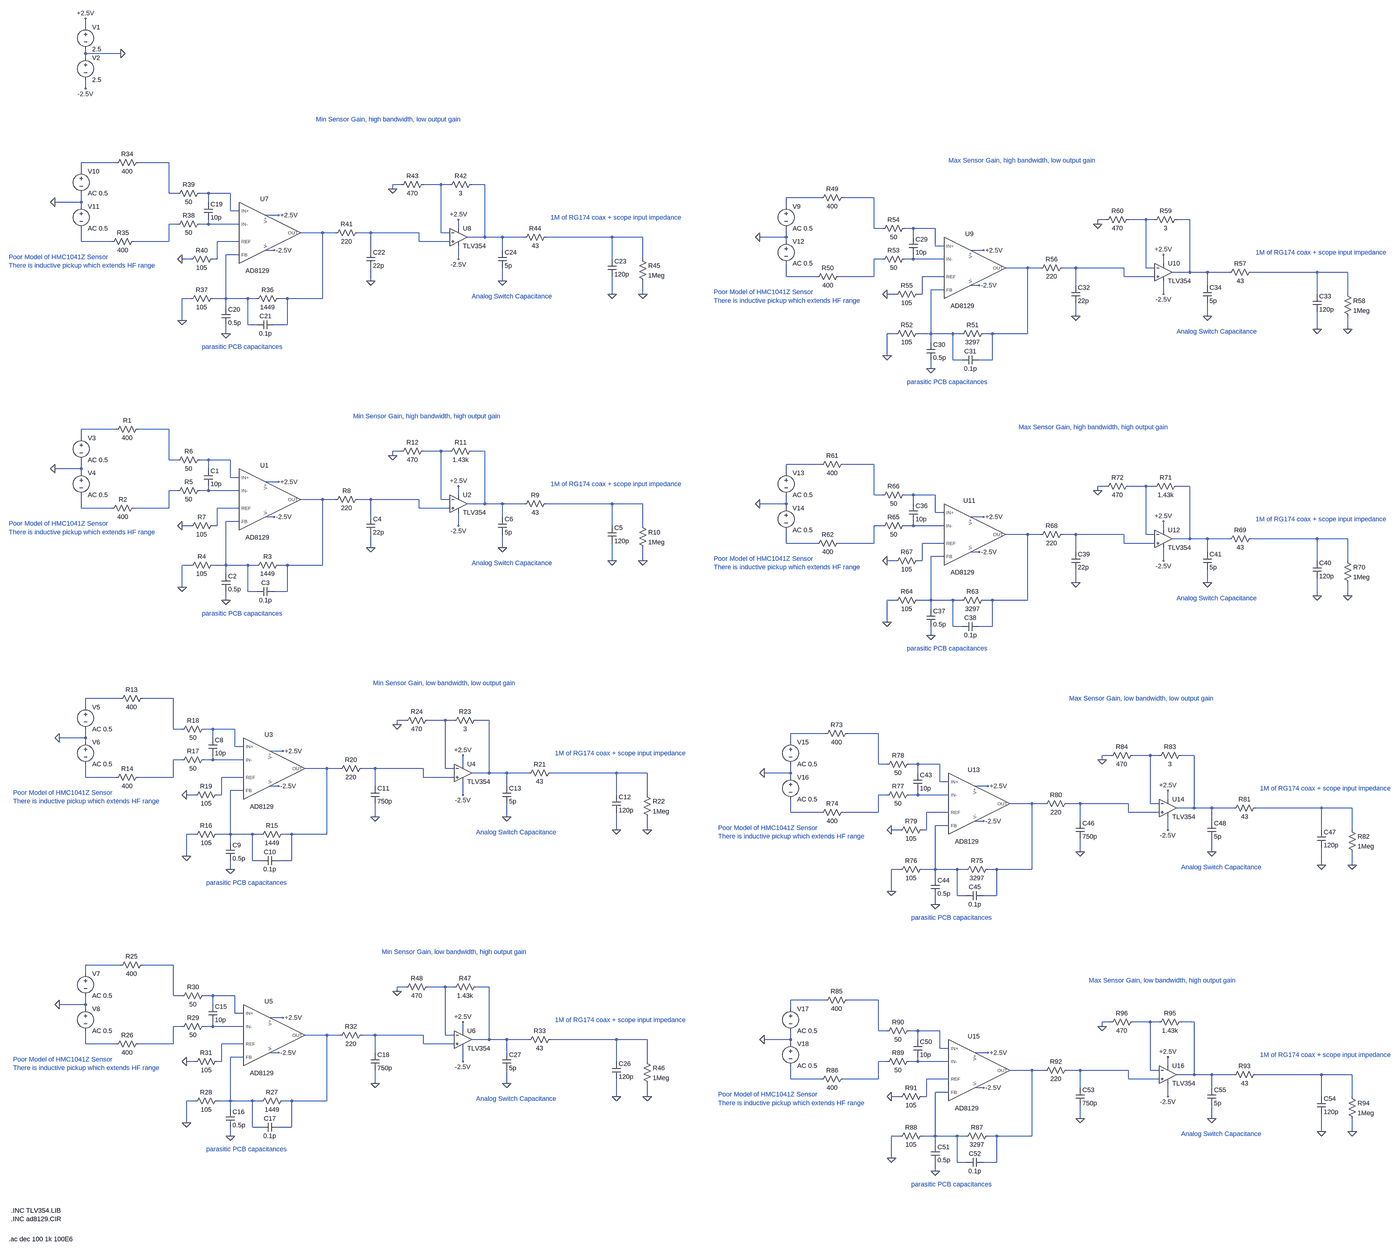
[diagram p0: schematic amplifier.asc, whole sheet]
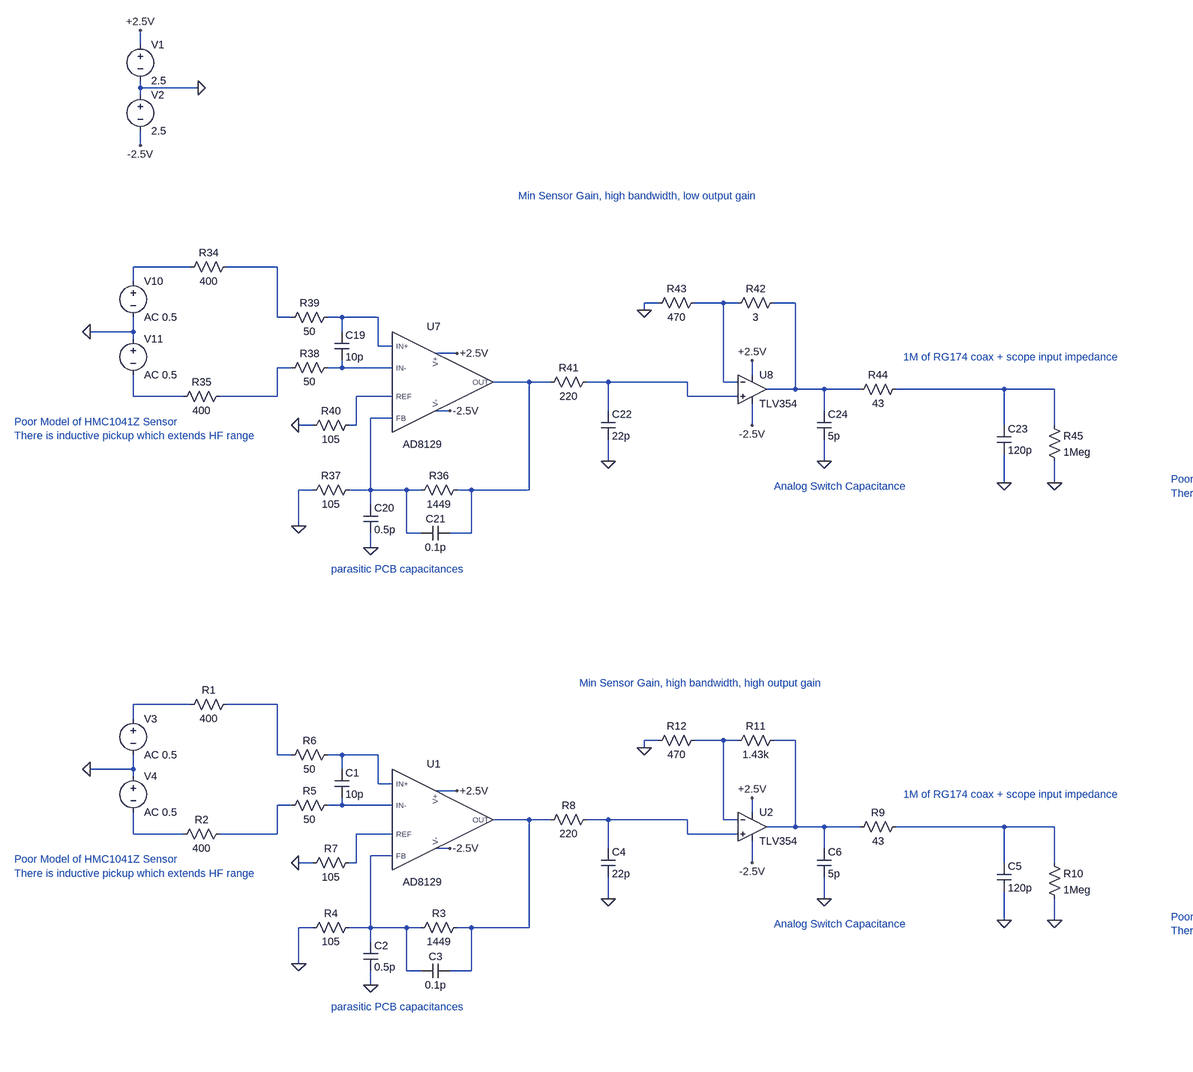
[diagram p1: schematic amplifier.asc, part, row 1 of 2, column 1 of 2]
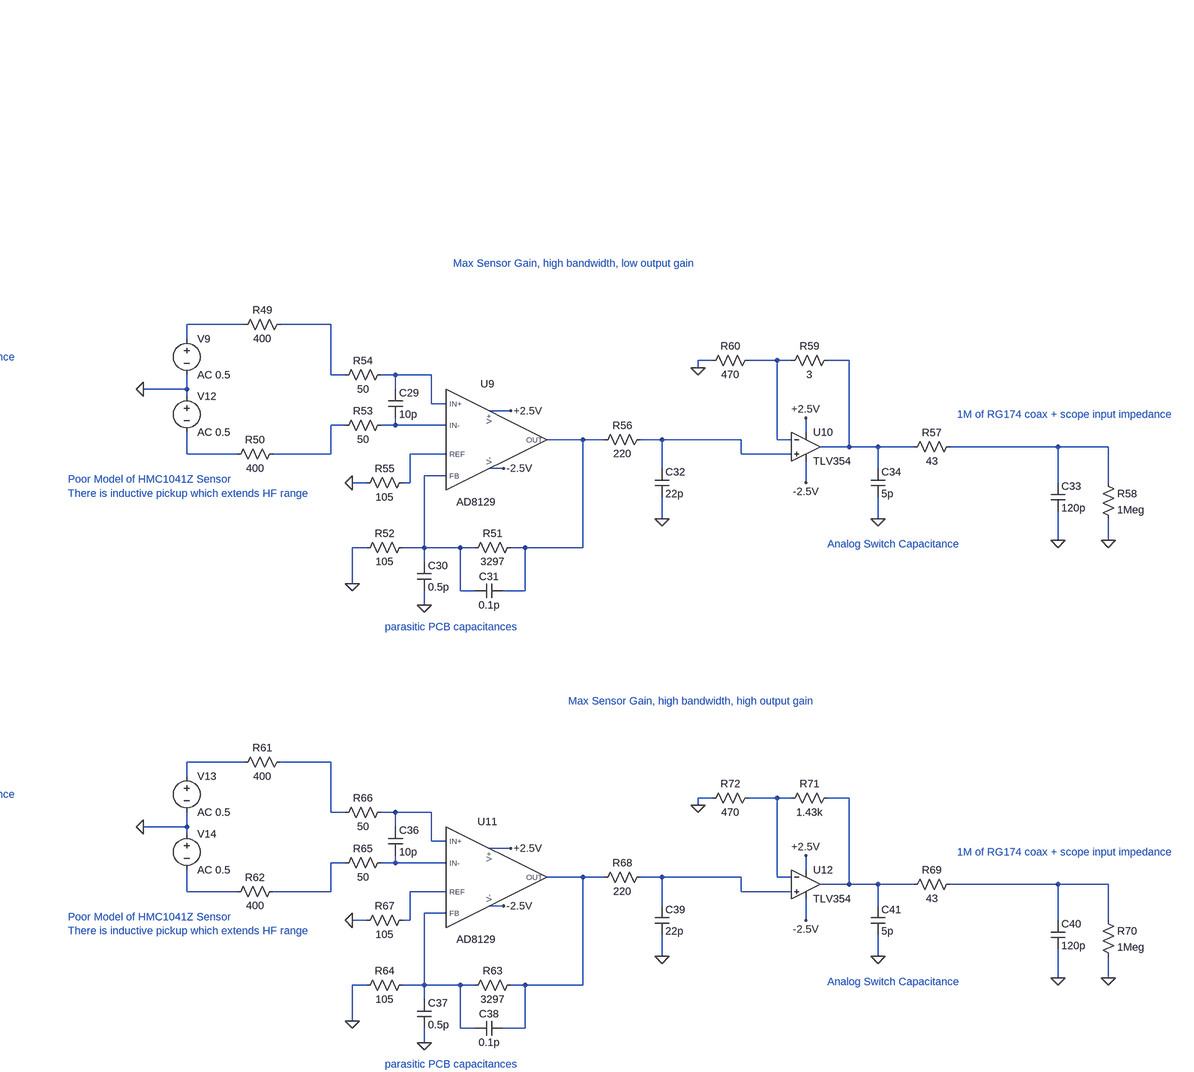
[diagram p2: schematic amplifier.asc, part, row 1 of 2, column 2 of 2]
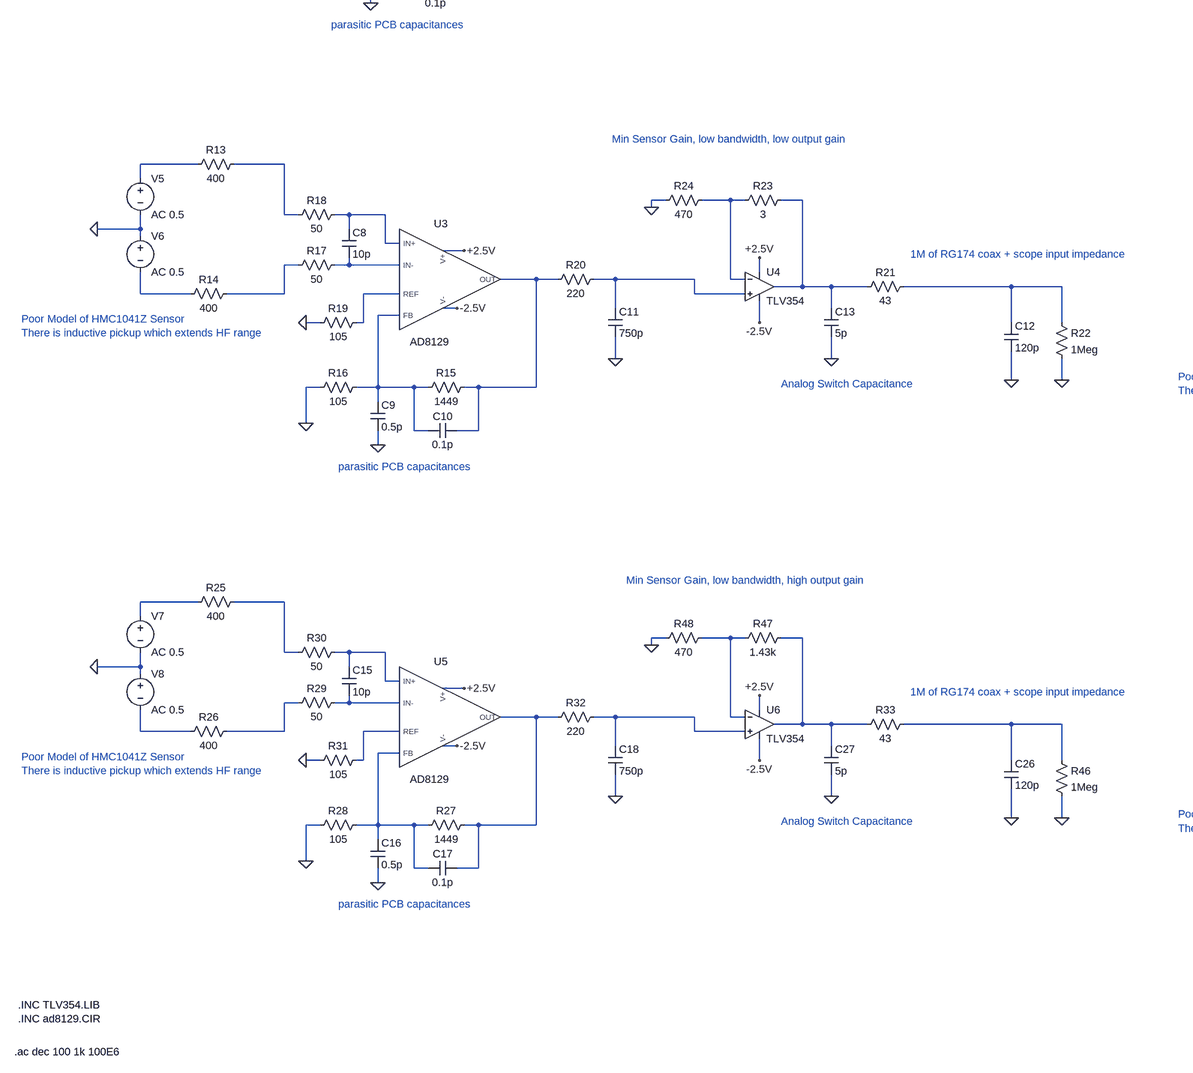
[diagram p3: schematic amplifier.asc, part, row 2 of 2, column 1 of 2]
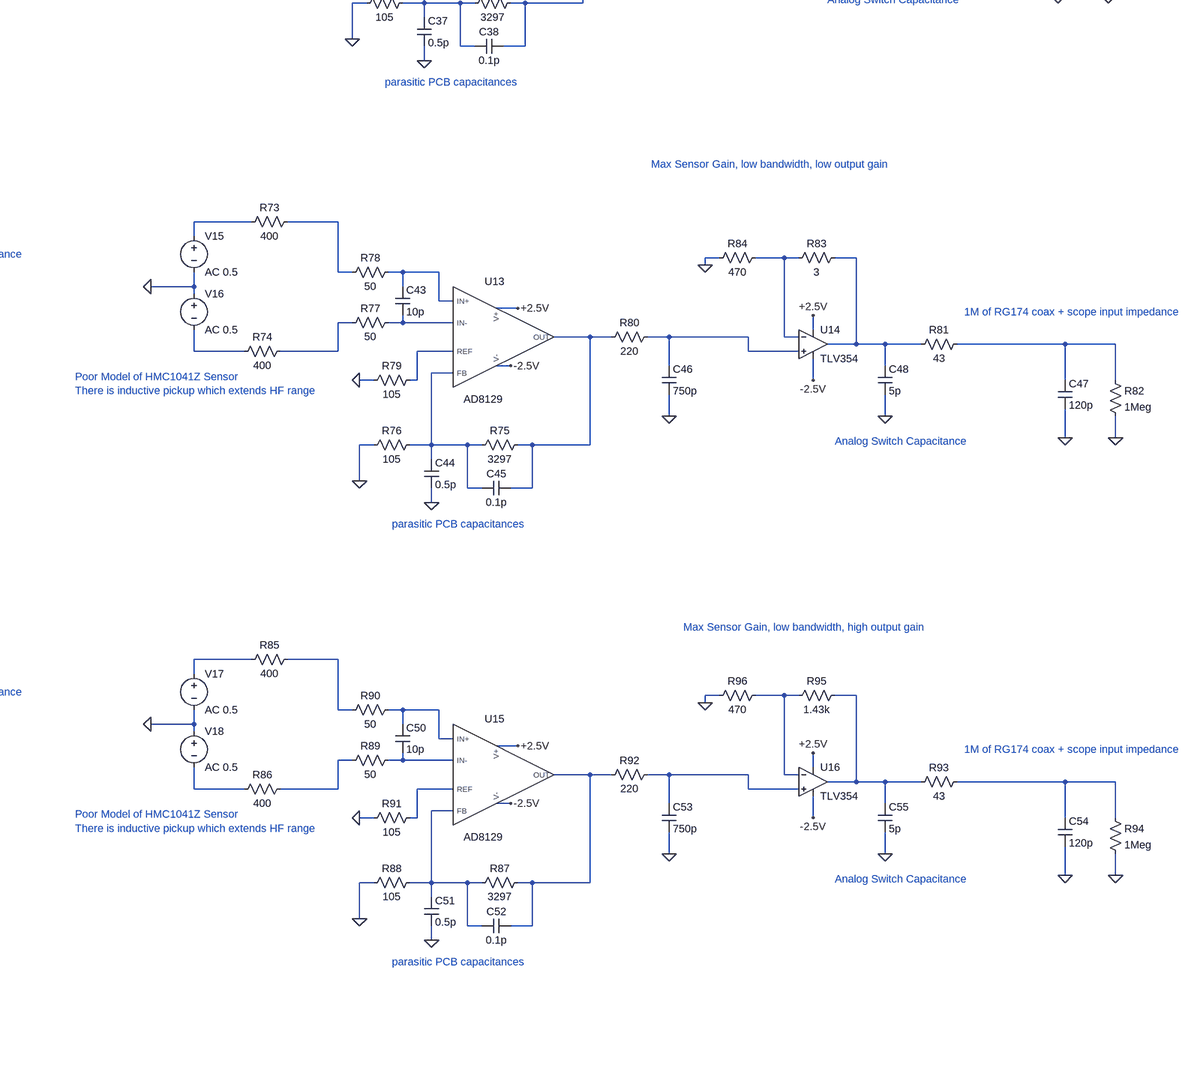
[diagram p4: schematic amplifier.asc, part, row 2 of 2, column 2 of 2]
amplifier.asc, the LTspice schematic file:
Version 4
SHEET 1 3488 3368
WIRE -2000 -1584 -2000 -1616
WIRE -2000 -1488 -2000 -1504
WIRE -1872 -1488 -2000 -1488
WIRE -2000 -1472 -2000 -1488
WIRE -2000 -1360 -2000 -1392
WIRE -1888 -1088 -2016 -1088
WIRE -1696 -1088 -1808 -1088
WIRE -2016 -1056 -2016 -1088
WIRE -848 -1008 -880 -1008
WIRE -704 -1008 -768 -1008
WIRE -672 -1008 -704 -1008
WIRE -544 -1008 -592 -1008
WIRE -880 -992 -880 -1008
WIRE -1696 -976 -1696 -1088
WIRE -1664 -976 -1696 -976
WIRE -1552 -976 -1584 -976
WIRE -1472 -976 -1552 -976
WIRE 1376 -960 1248 -960
WIRE 1568 -960 1456 -960
WIRE -2016 -944 -2016 -976
WIRE -2016 -944 -2112 -944
WIRE -1552 -944 -1552 -976
WIRE -2016 -928 -2016 -944
WIRE 1248 -928 1248 -960
WIRE -1472 -912 -1472 -976
WIRE -1440 -912 -1472 -912
WIRE -1296 -896 -1344 -896
WIRE 2416 -880 2384 -880
WIRE 2560 -880 2496 -880
WIRE 2592 -880 2560 -880
WIRE 2720 -880 2672 -880
WIRE -1664 -864 -1696 -864
WIRE -1552 -864 -1552 -880
WIRE -1552 -864 -1584 -864
WIRE -1440 -864 -1552 -864
WIRE 2384 -864 2384 -880
WIRE -640 -848 -640 -880
WIRE 1568 -848 1568 -960
WIRE 1600 -848 1568 -848
WIRE 1712 -848 1680 -848
WIRE 1792 -848 1712 -848
WIRE -1136 -832 -1216 -832
WIRE -1088 -832 -1136 -832
WIRE -960 -832 -1008 -832
WIRE -784 -832 -960 -832
WIRE -704 -832 -704 -1008
WIRE -672 -832 -704 -832
WIRE -544 -816 -544 -1008
WIRE -544 -816 -608 -816
WIRE -480 -816 -544 -816
WIRE -400 -816 -480 -816
WIRE -80 -816 -320 -816
WIRE 32 -816 -80 -816
WIRE 1248 -816 1248 -848
WIRE 1248 -816 1152 -816
WIRE 1712 -816 1712 -848
WIRE -2016 -800 -2016 -848
WIRE -1904 -800 -2016 -800
WIRE -1696 -800 -1696 -864
WIRE -1696 -800 -1824 -800
WIRE -1440 -800 -1520 -800
WIRE -784 -800 -784 -832
WIRE -672 -800 -784 -800
WIRE 1248 -800 1248 -816
WIRE 1792 -784 1792 -848
WIRE 1824 -784 1792 -784
WIRE -1312 -768 -1344 -768
WIRE -960 -768 -960 -832
WIRE -480 -768 -480 -816
WIRE 1968 -768 1920 -768
WIRE -1440 -752 -1488 -752
WIRE -1616 -736 -1648 -736
WIRE -1520 -736 -1520 -800
WIRE -1520 -736 -1536 -736
WIRE -640 -736 -640 -784
WIRE -80 -736 -80 -816
WIRE 32 -736 32 -816
WIRE 1600 -736 1568 -736
WIRE 1712 -736 1712 -752
WIRE 1712 -736 1680 -736
WIRE 1824 -736 1712 -736
WIRE 2624 -720 2624 -752
WIRE 2128 -704 2048 -704
WIRE 2176 -704 2128 -704
WIRE 2304 -704 2256 -704
WIRE 2480 -704 2304 -704
WIRE 2560 -704 2560 -880
WIRE 2592 -704 2560 -704
WIRE 2720 -688 2720 -880
WIRE 2720 -688 2656 -688
WIRE 2784 -688 2720 -688
WIRE 2864 -688 2784 -688
WIRE 3184 -688 2944 -688
WIRE 3296 -688 3184 -688
WIRE 1248 -672 1248 -720
WIRE 1360 -672 1248 -672
WIRE 1568 -672 1568 -736
WIRE 1568 -672 1440 -672
WIRE 1824 -672 1744 -672
WIRE 2480 -672 2480 -704
WIRE 2592 -672 2480 -672
WIRE -960 -656 -960 -704
WIRE -480 -656 -480 -704
WIRE 1952 -640 1920 -640
WIRE 2304 -640 2304 -704
WIRE 2784 -640 2784 -688
WIRE 1824 -624 1776 -624
WIRE -80 -608 -80 -672
WIRE 32 -608 32 -656
WIRE 1648 -608 1616 -608
WIRE 1744 -608 1744 -672
WIRE 1744 -608 1728 -608
WIRE 2624 -608 2624 -656
WIRE 3184 -608 3184 -688
WIRE 3296 -608 3296 -688
WIRE -1616 -592 -1648 -592
WIRE -1488 -592 -1488 -752
WIRE -1488 -592 -1536 -592
WIRE -1408 -592 -1488 -592
WIRE -1376 -592 -1408 -592
WIRE -1264 -592 -1296 -592
WIRE -1136 -592 -1136 -832
WIRE -1136 -592 -1264 -592
WIRE -1488 -560 -1488 -592
WIRE 2304 -528 2304 -576
WIRE 2784 -528 2784 -576
WIRE -1648 -512 -1648 -592
WIRE -1408 -496 -1408 -592
WIRE -1376 -496 -1408 -496
WIRE -1264 -496 -1264 -592
WIRE -1264 -496 -1312 -496
WIRE 3184 -480 3184 -544
WIRE 3296 -480 3296 -528
WIRE -1488 -464 -1488 -496
WIRE 1648 -464 1616 -464
WIRE 1776 -464 1776 -624
WIRE 1776 -464 1728 -464
WIRE 1856 -464 1776 -464
WIRE 1888 -464 1856 -464
WIRE 2000 -464 1968 -464
WIRE 2128 -464 2128 -704
WIRE 2128 -464 2000 -464
WIRE 1776 -432 1776 -464
WIRE 1616 -384 1616 -464
WIRE 1856 -368 1856 -464
WIRE 1888 -368 1856 -368
WIRE 2000 -368 2000 -464
WIRE 2000 -368 1952 -368
WIRE 1776 -336 1776 -368
WIRE -1888 0 -2016 0
WIRE -1696 0 -1808 0
WIRE -2016 32 -2016 0
WIRE -848 80 -880 80
WIRE -704 80 -768 80
WIRE -672 80 -704 80
WIRE -544 80 -592 80
WIRE -880 96 -880 80
WIRE -1696 112 -1696 0
WIRE -1664 112 -1696 112
WIRE -1552 112 -1584 112
WIRE -1472 112 -1552 112
WIRE 1376 128 1248 128
WIRE 1568 128 1456 128
WIRE -2016 144 -2016 112
WIRE -2016 144 -2112 144
WIRE -1552 144 -1552 112
WIRE -2016 160 -2016 144
WIRE 1248 160 1248 128
WIRE -1472 176 -1472 112
WIRE -1440 176 -1472 176
WIRE -1296 192 -1344 192
WIRE 2416 208 2384 208
WIRE 2560 208 2496 208
WIRE 2592 208 2560 208
WIRE 2720 208 2672 208
WIRE -1664 224 -1696 224
WIRE -1552 224 -1552 208
WIRE -1552 224 -1584 224
WIRE -1440 224 -1552 224
WIRE 2384 224 2384 208
WIRE -640 240 -640 208
WIRE 1568 240 1568 128
WIRE 1600 240 1568 240
WIRE 1712 240 1680 240
WIRE 1792 240 1712 240
WIRE -1136 256 -1216 256
WIRE -1088 256 -1136 256
WIRE -960 256 -1008 256
WIRE -784 256 -960 256
WIRE -704 256 -704 80
WIRE -672 256 -704 256
WIRE -544 272 -544 80
WIRE -544 272 -608 272
WIRE -480 272 -544 272
WIRE -400 272 -480 272
WIRE -80 272 -320 272
WIRE 32 272 -80 272
WIRE 1248 272 1248 240
WIRE 1248 272 1152 272
WIRE 1712 272 1712 240
WIRE -2016 288 -2016 240
WIRE -1904 288 -2016 288
WIRE -1696 288 -1696 224
WIRE -1696 288 -1824 288
WIRE -1440 288 -1520 288
WIRE -784 288 -784 256
WIRE -672 288 -784 288
WIRE 1248 288 1248 272
WIRE 1792 304 1792 240
WIRE 1824 304 1792 304
WIRE -1312 320 -1344 320
WIRE -960 320 -960 256
WIRE -480 320 -480 272
WIRE 1968 320 1920 320
WIRE -1440 336 -1488 336
WIRE -1616 352 -1648 352
WIRE -1520 352 -1520 288
WIRE -1520 352 -1536 352
WIRE -640 352 -640 304
WIRE -80 352 -80 272
WIRE 32 352 32 272
WIRE 1600 352 1568 352
WIRE 1712 352 1712 336
WIRE 1712 352 1680 352
WIRE 1824 352 1712 352
WIRE 2624 368 2624 336
WIRE 2128 384 2048 384
WIRE 2176 384 2128 384
WIRE 2304 384 2256 384
WIRE 2480 384 2304 384
WIRE 2560 384 2560 208
WIRE 2592 384 2560 384
WIRE 2720 400 2720 208
WIRE 2720 400 2656 400
WIRE 2784 400 2720 400
WIRE 2864 400 2784 400
WIRE 3184 400 2944 400
WIRE 3296 400 3184 400
WIRE 1248 416 1248 368
WIRE 1360 416 1248 416
WIRE 1568 416 1568 352
WIRE 1568 416 1440 416
WIRE 1824 416 1744 416
WIRE 2480 416 2480 384
WIRE 2592 416 2480 416
WIRE -960 432 -960 384
WIRE -480 432 -480 384
WIRE 1952 448 1920 448
WIRE 2304 448 2304 384
WIRE 2784 448 2784 400
WIRE 1824 464 1776 464
WIRE -80 480 -80 416
WIRE 32 480 32 432
WIRE 1648 480 1616 480
WIRE 1744 480 1744 416
WIRE 1744 480 1728 480
WIRE 2624 480 2624 432
WIRE 3184 480 3184 400
WIRE 3296 480 3296 400
WIRE -1616 496 -1648 496
WIRE -1488 496 -1488 336
WIRE -1488 496 -1536 496
WIRE -1408 496 -1488 496
WIRE -1376 496 -1408 496
WIRE -1264 496 -1296 496
WIRE -1136 496 -1136 256
WIRE -1136 496 -1264 496
WIRE -1488 528 -1488 496
WIRE 2304 560 2304 512
WIRE 2784 560 2784 512
WIRE -1648 576 -1648 496
WIRE -1408 592 -1408 496
WIRE -1376 592 -1408 592
WIRE -1264 592 -1264 496
WIRE -1264 592 -1312 592
WIRE 3184 608 3184 544
WIRE 3296 608 3296 560
WIRE -1488 624 -1488 592
WIRE 1648 624 1616 624
WIRE 1776 624 1776 464
WIRE 1776 624 1728 624
WIRE 1856 624 1776 624
WIRE 1888 624 1856 624
WIRE 2000 624 1968 624
WIRE 2128 624 2128 384
WIRE 2128 624 2000 624
WIRE 1776 656 1776 624
WIRE 1616 704 1616 624
WIRE 1856 720 1856 624
WIRE 1888 720 1856 720
WIRE 2000 720 2000 624
WIRE 2000 720 1952 720
WIRE 1776 752 1776 720
WIRE -1872 1264 -2000 1264
WIRE -1680 1264 -1792 1264
WIRE -2000 1296 -2000 1264
WIRE -832 1344 -864 1344
WIRE -688 1344 -752 1344
WIRE -656 1344 -688 1344
WIRE -528 1344 -576 1344
WIRE -864 1360 -864 1344
WIRE -1680 1376 -1680 1264
WIRE -1648 1376 -1680 1376
WIRE -1536 1376 -1568 1376
WIRE -1456 1376 -1536 1376
WIRE 1392 1392 1264 1392
WIRE 1584 1392 1472 1392
WIRE -2000 1408 -2000 1376
WIRE -2000 1408 -2096 1408
WIRE -1536 1408 -1536 1376
WIRE -2000 1424 -2000 1408
WIRE 1264 1424 1264 1392
WIRE -1456 1440 -1456 1376
WIRE -1424 1440 -1456 1440
WIRE -1280 1456 -1328 1456
WIRE 2432 1472 2400 1472
WIRE 2576 1472 2512 1472
WIRE 2608 1472 2576 1472
WIRE 2736 1472 2688 1472
WIRE -1648 1488 -1680 1488
WIRE -1536 1488 -1536 1472
WIRE -1536 1488 -1568 1488
WIRE -1424 1488 -1536 1488
WIRE 2400 1488 2400 1472
WIRE -624 1504 -624 1472
WIRE 1584 1504 1584 1392
WIRE 1616 1504 1584 1504
WIRE 1728 1504 1696 1504
WIRE 1808 1504 1728 1504
WIRE -1120 1520 -1200 1520
WIRE -1072 1520 -1120 1520
WIRE -944 1520 -992 1520
WIRE -768 1520 -944 1520
WIRE -688 1520 -688 1344
WIRE -656 1520 -688 1520
WIRE -528 1536 -528 1344
WIRE -528 1536 -592 1536
WIRE -464 1536 -528 1536
WIRE -384 1536 -464 1536
WIRE -64 1536 -304 1536
WIRE 48 1536 -64 1536
WIRE 1264 1536 1264 1504
WIRE 1264 1536 1168 1536
WIRE 1728 1536 1728 1504
WIRE -2000 1552 -2000 1504
WIRE -1888 1552 -2000 1552
WIRE -1680 1552 -1680 1488
WIRE -1680 1552 -1808 1552
WIRE -1424 1552 -1504 1552
WIRE -768 1552 -768 1520
WIRE -656 1552 -768 1552
WIRE 1264 1552 1264 1536
WIRE 1808 1568 1808 1504
WIRE 1840 1568 1808 1568
WIRE -1296 1584 -1328 1584
WIRE -944 1584 -944 1520
WIRE -464 1584 -464 1536
WIRE 1984 1584 1936 1584
WIRE -1424 1600 -1472 1600
WIRE -1600 1616 -1632 1616
WIRE -1504 1616 -1504 1552
WIRE -1504 1616 -1520 1616
WIRE -624 1616 -624 1568
WIRE -64 1616 -64 1536
WIRE 48 1616 48 1536
WIRE 1616 1616 1584 1616
WIRE 1728 1616 1728 1600
WIRE 1728 1616 1696 1616
WIRE 1840 1616 1728 1616
WIRE 2640 1632 2640 1600
WIRE 2144 1648 2064 1648
WIRE 2192 1648 2144 1648
WIRE 2320 1648 2272 1648
WIRE 2496 1648 2320 1648
WIRE 2576 1648 2576 1472
WIRE 2608 1648 2576 1648
WIRE 2736 1664 2736 1472
WIRE 2736 1664 2672 1664
WIRE 2800 1664 2736 1664
WIRE 2880 1664 2800 1664
WIRE 3200 1664 2960 1664
WIRE 3312 1664 3200 1664
WIRE 1264 1680 1264 1632
WIRE 1376 1680 1264 1680
WIRE 1584 1680 1584 1616
WIRE 1584 1680 1456 1680
WIRE 1840 1680 1760 1680
WIRE 2496 1680 2496 1648
WIRE 2608 1680 2496 1680
WIRE -944 1696 -944 1648
WIRE -464 1696 -464 1648
WIRE 1968 1712 1936 1712
WIRE 2320 1712 2320 1648
WIRE 2800 1712 2800 1664
WIRE 1840 1728 1792 1728
WIRE -64 1744 -64 1680
WIRE 48 1744 48 1696
WIRE 1664 1744 1632 1744
WIRE 1760 1744 1760 1680
WIRE 1760 1744 1744 1744
WIRE 2640 1744 2640 1696
WIRE 3200 1744 3200 1664
WIRE 3312 1744 3312 1664
WIRE -1600 1760 -1632 1760
WIRE -1472 1760 -1472 1600
WIRE -1472 1760 -1520 1760
WIRE -1392 1760 -1472 1760
WIRE -1360 1760 -1392 1760
WIRE -1248 1760 -1280 1760
WIRE -1120 1760 -1120 1520
WIRE -1120 1760 -1248 1760
WIRE -1472 1792 -1472 1760
WIRE 2320 1824 2320 1776
WIRE 2800 1824 2800 1776
WIRE -1632 1840 -1632 1760
WIRE -1392 1856 -1392 1760
WIRE -1360 1856 -1392 1856
WIRE -1248 1856 -1248 1760
WIRE -1248 1856 -1296 1856
WIRE 3200 1872 3200 1808
WIRE 3312 1872 3312 1824
WIRE -1472 1888 -1472 1856
WIRE 1664 1888 1632 1888
WIRE 1792 1888 1792 1728
WIRE 1792 1888 1744 1888
WIRE 1872 1888 1792 1888
WIRE 1904 1888 1872 1888
WIRE 2016 1888 1984 1888
WIRE 2144 1888 2144 1648
WIRE 2144 1888 2016 1888
WIRE 1792 1920 1792 1888
WIRE 1632 1968 1632 1888
WIRE 1872 1984 1872 1888
WIRE 1904 1984 1872 1984
WIRE 2016 1984 2016 1888
WIRE 2016 1984 1968 1984
WIRE 1792 2016 1792 1984
WIRE -1872 2352 -2000 2352
WIRE -1680 2352 -1792 2352
WIRE -2000 2384 -2000 2352
WIRE -832 2432 -864 2432
WIRE -688 2432 -752 2432
WIRE -656 2432 -688 2432
WIRE -528 2432 -576 2432
WIRE -864 2448 -864 2432
WIRE -1680 2464 -1680 2352
WIRE -1648 2464 -1680 2464
WIRE -1536 2464 -1568 2464
WIRE -1456 2464 -1536 2464
WIRE 1392 2480 1264 2480
WIRE 1584 2480 1472 2480
WIRE -2000 2496 -2000 2464
WIRE -2000 2496 -2096 2496
WIRE -1536 2496 -1536 2464
WIRE -2000 2512 -2000 2496
WIRE 1264 2512 1264 2480
WIRE -1456 2528 -1456 2464
WIRE -1424 2528 -1456 2528
WIRE -1280 2544 -1328 2544
WIRE 2432 2560 2400 2560
WIRE 2576 2560 2512 2560
WIRE 2608 2560 2576 2560
WIRE 2736 2560 2688 2560
WIRE -1648 2576 -1680 2576
WIRE -1536 2576 -1536 2560
WIRE -1536 2576 -1568 2576
WIRE -1424 2576 -1536 2576
WIRE 2400 2576 2400 2560
WIRE -624 2592 -624 2560
WIRE 1584 2592 1584 2480
WIRE 1616 2592 1584 2592
WIRE 1728 2592 1696 2592
WIRE 1808 2592 1728 2592
WIRE -1120 2608 -1200 2608
WIRE -1072 2608 -1120 2608
WIRE -944 2608 -992 2608
WIRE -768 2608 -944 2608
WIRE -688 2608 -688 2432
WIRE -656 2608 -688 2608
WIRE -528 2624 -528 2432
WIRE -528 2624 -592 2624
WIRE -464 2624 -528 2624
WIRE -384 2624 -464 2624
WIRE -64 2624 -304 2624
WIRE 48 2624 -64 2624
WIRE 1264 2624 1264 2592
WIRE 1264 2624 1168 2624
WIRE 1728 2624 1728 2592
WIRE -2000 2640 -2000 2592
WIRE -1888 2640 -2000 2640
WIRE -1680 2640 -1680 2576
WIRE -1680 2640 -1808 2640
WIRE -1424 2640 -1504 2640
WIRE -768 2640 -768 2608
WIRE -656 2640 -768 2640
WIRE 1264 2640 1264 2624
WIRE 1808 2656 1808 2592
WIRE 1840 2656 1808 2656
WIRE -1296 2672 -1328 2672
WIRE -944 2672 -944 2608
WIRE -464 2672 -464 2624
WIRE 1984 2672 1936 2672
WIRE -1424 2688 -1472 2688
WIRE -1600 2704 -1632 2704
WIRE -1504 2704 -1504 2640
WIRE -1504 2704 -1520 2704
WIRE -624 2704 -624 2656
WIRE -64 2704 -64 2624
WIRE 48 2704 48 2624
WIRE 1616 2704 1584 2704
WIRE 1728 2704 1728 2688
WIRE 1728 2704 1696 2704
WIRE 1840 2704 1728 2704
WIRE 2640 2720 2640 2688
WIRE 2144 2736 2064 2736
WIRE 2192 2736 2144 2736
WIRE 2320 2736 2272 2736
WIRE 2496 2736 2320 2736
WIRE 2576 2736 2576 2560
WIRE 2608 2736 2576 2736
WIRE 2736 2752 2736 2560
WIRE 2736 2752 2672 2752
WIRE 2800 2752 2736 2752
WIRE 2880 2752 2800 2752
WIRE 3200 2752 2960 2752
WIRE 3312 2752 3200 2752
WIRE 1264 2768 1264 2720
WIRE 1376 2768 1264 2768
WIRE 1584 2768 1584 2704
WIRE 1584 2768 1456 2768
WIRE 1840 2768 1760 2768
WIRE 2496 2768 2496 2736
WIRE 2608 2768 2496 2768
WIRE -944 2784 -944 2736
WIRE -464 2784 -464 2736
WIRE 1968 2800 1936 2800
WIRE 2320 2800 2320 2736
WIRE 2800 2800 2800 2752
WIRE 1840 2816 1792 2816
WIRE -64 2832 -64 2768
WIRE 48 2832 48 2784
WIRE 1664 2832 1632 2832
WIRE 1760 2832 1760 2768
WIRE 1760 2832 1744 2832
WIRE 2640 2832 2640 2784
WIRE 3200 2832 3200 2752
WIRE 3312 2832 3312 2752
WIRE -1600 2848 -1632 2848
WIRE -1472 2848 -1472 2688
WIRE -1472 2848 -1520 2848
WIRE -1392 2848 -1472 2848
WIRE -1360 2848 -1392 2848
WIRE -1248 2848 -1280 2848
WIRE -1120 2848 -1120 2608
WIRE -1120 2848 -1248 2848
WIRE -1472 2880 -1472 2848
WIRE 2320 2912 2320 2864
WIRE 2800 2912 2800 2864
WIRE -1632 2928 -1632 2848
WIRE -1392 2944 -1392 2848
WIRE -1360 2944 -1392 2944
WIRE -1248 2944 -1248 2848
WIRE -1248 2944 -1296 2944
WIRE 3200 2960 3200 2896
WIRE 3312 2960 3312 2912
WIRE -1472 2976 -1472 2944
WIRE 1664 2976 1632 2976
WIRE 1792 2976 1792 2816
WIRE 1792 2976 1744 2976
WIRE 1872 2976 1792 2976
WIRE 1904 2976 1872 2976
WIRE 2016 2976 1984 2976
WIRE 2144 2976 2144 2736
WIRE 2144 2976 2016 2976
WIRE 1792 3008 1792 2976
WIRE 1632 3056 1632 2976
WIRE 1872 3072 1872 2976
WIRE 1904 3072 1872 3072
WIRE 2016 3072 2016 2976
WIRE 2016 3072 1968 3072
WIRE 1792 3104 1792 3072
FLAG -1872 -1488 0
FLAG -2000 -1616 +2.5V
FLAG -2000 -1360 -2.5V
FLAG -1648 -512 0
FLAG -2112 -944 0
FLAG -1648 -736 0
FLAG -1296 -896 +2.5V
FLAG -1312 -768 -2.5V
FLAG -1488 -464 0
FLAG -960 -656 0
FLAG -80 -608 0
FLAG 32 -608 0
FLAG -640 -736 -2.5V
FLAG -640 -880 +2.5V
FLAG -480 -656 0
FLAG -880 -992 0
FLAG -1648 576 0
FLAG -2112 144 0
FLAG -1648 352 0
FLAG -1296 192 +2.5V
FLAG -1312 320 -2.5V
FLAG -1488 624 0
FLAG -960 432 0
FLAG -80 480 0
FLAG 32 480 0
FLAG -640 352 -2.5V
FLAG -640 208 +2.5V
FLAG -480 432 0
FLAG -880 96 0
FLAG -1632 1840 0
FLAG -2096 1408 0
FLAG -1632 1616 0
FLAG -1280 1456 +2.5V
FLAG -1296 1584 -2.5V
FLAG -1472 1888 0
FLAG -944 1696 0
FLAG -64 1744 0
FLAG 48 1744 0
FLAG -624 1616 -2.5V
FLAG -624 1472 +2.5V
FLAG -464 1696 0
FLAG -864 1360 0
FLAG -1632 2928 0
FLAG -2096 2496 0
FLAG -1632 2704 0
FLAG -1280 2544 +2.5V
FLAG -1296 2672 -2.5V
FLAG -1472 2976 0
FLAG -944 2784 0
FLAG -64 2832 0
FLAG 48 2832 0
FLAG -624 2704 -2.5V
FLAG -624 2560 +2.5V
FLAG -464 2784 0
FLAG -864 2448 0
FLAG 1616 -384 0
FLAG 1152 -816 0
FLAG 1616 -608 0
FLAG 1968 -768 +2.5V
FLAG 1952 -640 -2.5V
FLAG 1776 -336 0
FLAG 2304 -528 0
FLAG 3184 -480 0
FLAG 3296 -480 0
FLAG 2624 -608 -2.5V
FLAG 2624 -752 +2.5V
FLAG 2784 -528 0
FLAG 2384 -864 0
FLAG 1616 704 0
FLAG 1152 272 0
FLAG 1616 480 0
FLAG 1968 320 +2.5V
FLAG 1952 448 -2.5V
FLAG 1776 752 0
FLAG 2304 560 0
FLAG 3184 608 0
FLAG 3296 608 0
FLAG 2624 480 -2.5V
FLAG 2624 336 +2.5V
FLAG 2784 560 0
FLAG 2384 224 0
FLAG 1632 1968 0
FLAG 1168 1536 0
FLAG 1632 1744 0
FLAG 1984 1584 +2.5V
FLAG 1968 1712 -2.5V
FLAG 1792 2016 0
FLAG 2320 1824 0
FLAG 3200 1872 0
FLAG 3312 1872 0
FLAG 2640 1744 -2.5V
FLAG 2640 1600 +2.5V
FLAG 2800 1824 0
FLAG 2400 1488 0
FLAG 1632 3056 0
FLAG 1168 2624 0
FLAG 1632 2832 0
FLAG 1984 2672 +2.5V
FLAG 1968 2800 -2.5V
FLAG 1792 3104 0
FLAG 2320 2912 0
FLAG 3200 2960 0
FLAG 3312 2960 0
FLAG 2640 2832 -2.5V
FLAG 2640 2688 +2.5V
FLAG 2800 2912 0
FLAG 2400 2576 0
SYMBOL voltage -2000 -1600 R0
WINDOW 123 0 0 Left 2
WINDOW 39 0 0 Left 2
SYMATTR InstName V1
SYMATTR Value 2.5
SYMBOL voltage -2000 -1488 R0
WINDOW 123 0 0 Left 2
WINDOW 39 0 0 Left 2
SYMATTR InstName V2
SYMATTR Value 2.5
SYMBOL res -1792 -1104 R90
WINDOW 0 0 56 VBottom 2
WINDOW 3 32 56 VTop 2
SYMATTR InstName R34
SYMATTR Value 400
SYMBOL res -1808 -816 R90
WINDOW 0 0 56 VBottom 2
WINDOW 3 32 56 VTop 2
SYMATTR InstName R35
SYMATTR Value 400
SYMBOL res -1280 -608 R90
WINDOW 0 0 56 VBottom 2
WINDOW 3 32 56 VTop 2
SYMATTR InstName R36
SYMATTR Value 1449
SYMBOL res -1520 -608 R90
WINDOW 0 0 56 VBottom 2
WINDOW 3 32 56 VTop 2
SYMATTR InstName R37
SYMATTR Value 105
SYMBOL voltage -2016 -1072 R0
WINDOW 123 0 0 Left 2
WINDOW 39 0 0 Left 2
SYMATTR InstName V10
SYMATTR Value AC 0.5
SYMBOL voltage -2016 -944 R0
WINDOW 123 0 0 Left 2
WINDOW 39 0 0 Left 2
SYMATTR InstName V11
SYMATTR Value AC 0.5
SYMBOL res -1568 -880 R90
WINDOW 0 0 56 VBottom 2
WINDOW 3 32 56 VTop 2
SYMATTR InstName R38
SYMATTR Value 50
SYMBOL res -1568 -992 R90
WINDOW 0 0 56 VBottom 2
WINDOW 3 32 56 VTop 2
SYMATTR InstName R39
SYMATTR Value 50
SYMBOL cap -1568 -944 R0
SYMATTR InstName C19
SYMATTR Value 10p
SYMBOL res -1520 -752 R90
WINDOW 0 0 56 VBottom 2
WINDOW 3 32 56 VTop 2
SYMATTR InstName R40
SYMATTR Value 105
SYMBOL cap -1504 -560 R0
SYMATTR InstName C20
SYMATTR Value 0.5p
SYMBOL cap -1312 -512 R90
WINDOW 0 0 32 VBottom 2
WINDOW 3 32 32 VTop 2
SYMATTR InstName C21
SYMATTR Value 0.1p
SYMBOL AD8129 -1360 -832 R0
WINDOW 0 12 -108 Bottom 2
SYMATTR InstName U7
SYMBOL res -1104 -816 R270
WINDOW 0 32 56 VTop 2
WINDOW 3 0 56 VBottom 2
SYMATTR InstName R41
SYMATTR Value 220
SYMBOL cap -976 -768 R0
SYMATTR InstName C22
SYMATTR Value 22p
SYMBOL res -304 -832 R90
WINDOW 0 0 56 VBottom 2
WINDOW 3 32 56 VTop 2
SYMATTR InstName R44
SYMATTR Value 43
SYMBOL cap -96 -736 R0
SYMATTR InstName C23
SYMATTR Value 120p
SYMBOL res 16 -752 R0
SYMATTR InstName R45
SYMATTR Value 1Meg
SYMBOL opamp2 -640 -880 R0
SYMATTR InstName U8
SYMATTR Value TLV354
SYMBOL res -576 -1024 R90
WINDOW 0 0 56 VBottom 2
WINDOW 3 32 56 VTop 2
SYMATTR InstName R42
SYMATTR Value 3
SYMBOL cap -496 -768 R0
SYMATTR InstName C24
SYMATTR Value 5p
SYMBOL res -752 -1024 R90
WINDOW 0 0 56 VBottom 2
WINDOW 3 32 56 VTop 2
SYMATTR InstName R43
SYMATTR Value 470
SYMBOL res -1792 -16 R90
WINDOW 0 0 56 VBottom 2
WINDOW 3 32 56 VTop 2
SYMATTR InstName R1
SYMATTR Value 400
SYMBOL res -1808 272 R90
WINDOW 0 0 56 VBottom 2
WINDOW 3 32 56 VTop 2
SYMATTR InstName R2
SYMATTR Value 400
SYMBOL res -1280 480 R90
WINDOW 0 0 56 VBottom 2
WINDOW 3 32 56 VTop 2
SYMATTR InstName R3
SYMATTR Value 1449
SYMBOL res -1520 480 R90
WINDOW 0 0 56 VBottom 2
WINDOW 3 32 56 VTop 2
SYMATTR InstName R4
SYMATTR Value 105
SYMBOL voltage -2016 16 R0
WINDOW 123 0 0 Left 2
WINDOW 39 0 0 Left 2
SYMATTR InstName V3
SYMATTR Value AC 0.5
SYMBOL voltage -2016 144 R0
WINDOW 123 0 0 Left 2
WINDOW 39 0 0 Left 2
SYMATTR InstName V4
SYMATTR Value AC 0.5
SYMBOL res -1568 208 R90
WINDOW 0 0 56 VBottom 2
WINDOW 3 32 56 VTop 2
SYMATTR InstName R5
SYMATTR Value 50
SYMBOL res -1568 96 R90
WINDOW 0 0 56 VBottom 2
WINDOW 3 32 56 VTop 2
SYMATTR InstName R6
SYMATTR Value 50
SYMBOL cap -1568 144 R0
SYMATTR InstName C1
SYMATTR Value 10p
SYMBOL res -1520 336 R90
WINDOW 0 0 56 VBottom 2
WINDOW 3 32 56 VTop 2
SYMATTR InstName R7
SYMATTR Value 105
SYMBOL cap -1504 528 R0
SYMATTR InstName C2
SYMATTR Value 0.5p
SYMBOL cap -1312 576 R90
WINDOW 0 0 32 VBottom 2
WINDOW 3 32 32 VTop 2
SYMATTR InstName C3
SYMATTR Value 0.1p
SYMBOL AD8129 -1360 256 R0
WINDOW 0 12 -108 Bottom 2
SYMATTR InstName U1
SYMBOL res -1104 272 R270
WINDOW 0 32 56 VTop 2
WINDOW 3 0 56 VBottom 2
SYMATTR InstName R8
SYMATTR Value 220
SYMBOL cap -976 320 R0
SYMATTR InstName C4
SYMATTR Value 22p
SYMBOL res -304 256 R90
WINDOW 0 0 56 VBottom 2
WINDOW 3 32 56 VTop 2
SYMATTR InstName R9
SYMATTR Value 43
SYMBOL cap -96 352 R0
SYMATTR InstName C5
SYMATTR Value 120p
SYMBOL res 16 336 R0
SYMATTR InstName R10
SYMATTR Value 1Meg
SYMBOL opamp2 -640 208 R0
SYMATTR InstName U2
SYMATTR Value TLV354
SYMBOL res -576 64 R90
WINDOW 0 0 56 VBottom 2
WINDOW 3 32 56 VTop 2
SYMATTR InstName R11
SYMATTR Value 1.43k
SYMBOL cap -496 320 R0
SYMATTR InstName C6
SYMATTR Value 5p
SYMBOL res -752 64 R90
WINDOW 0 0 56 VBottom 2
WINDOW 3 32 56 VTop 2
SYMATTR InstName R12
SYMATTR Value 470
SYMBOL res -1776 1248 R90
WINDOW 0 0 56 VBottom 2
WINDOW 3 32 56 VTop 2
SYMATTR InstName R13
SYMATTR Value 400
SYMBOL res -1792 1536 R90
WINDOW 0 0 56 VBottom 2
WINDOW 3 32 56 VTop 2
SYMATTR InstName R14
SYMATTR Value 400
SYMBOL res -1264 1744 R90
WINDOW 0 0 56 VBottom 2
WINDOW 3 32 56 VTop 2
SYMATTR InstName R15
SYMATTR Value 1449
SYMBOL res -1504 1744 R90
WINDOW 0 0 56 VBottom 2
WINDOW 3 32 56 VTop 2
SYMATTR InstName R16
SYMATTR Value 105
SYMBOL voltage -2000 1280 R0
WINDOW 123 0 0 Left 2
WINDOW 39 0 0 Left 2
SYMATTR InstName V5
SYMATTR Value AC 0.5
SYMBOL voltage -2000 1408 R0
WINDOW 123 0 0 Left 2
WINDOW 39 0 0 Left 2
SYMATTR InstName V6
SYMATTR Value AC 0.5
SYMBOL res -1552 1472 R90
WINDOW 0 0 56 VBottom 2
WINDOW 3 32 56 VTop 2
SYMATTR InstName R17
SYMATTR Value 50
SYMBOL res -1552 1360 R90
WINDOW 0 0 56 VBottom 2
WINDOW 3 32 56 VTop 2
SYMATTR InstName R18
SYMATTR Value 50
SYMBOL cap -1552 1408 R0
SYMATTR InstName C8
SYMATTR Value 10p
SYMBOL res -1504 1600 R90
WINDOW 0 0 56 VBottom 2
WINDOW 3 32 56 VTop 2
SYMATTR InstName R19
SYMATTR Value 105
SYMBOL cap -1488 1792 R0
SYMATTR InstName C9
SYMATTR Value 0.5p
SYMBOL cap -1296 1840 R90
WINDOW 0 0 32 VBottom 2
WINDOW 3 32 32 VTop 2
SYMATTR InstName C10
SYMATTR Value 0.1p
SYMBOL AD8129 -1344 1520 R0
WINDOW 0 12 -108 Bottom 2
SYMATTR InstName U3
SYMBOL res -1088 1536 R270
WINDOW 0 32 56 VTop 2
WINDOW 3 0 56 VBottom 2
SYMATTR InstName R20
SYMATTR Value 220
SYMBOL cap -960 1584 R0
SYMATTR InstName C11
SYMATTR Value 750p
SYMBOL res -288 1520 R90
WINDOW 0 0 56 VBottom 2
WINDOW 3 32 56 VTop 2
SYMATTR InstName R21
SYMATTR Value 43
SYMBOL cap -80 1616 R0
SYMATTR InstName C12
SYMATTR Value 120p
SYMBOL res 32 1600 R0
SYMATTR InstName R22
SYMATTR Value 1Meg
SYMBOL opamp2 -624 1472 R0
SYMATTR InstName U4
SYMATTR Value TLV354
SYMBOL res -560 1328 R90
WINDOW 0 0 56 VBottom 2
WINDOW 3 32 56 VTop 2
SYMATTR InstName R23
SYMATTR Value 3
SYMBOL cap -480 1584 R0
SYMATTR InstName C13
SYMATTR Value 5p
SYMBOL res -736 1328 R90
WINDOW 0 0 56 VBottom 2
WINDOW 3 32 56 VTop 2
SYMATTR InstName R24
SYMATTR Value 470
SYMBOL res -1776 2336 R90
WINDOW 0 0 56 VBottom 2
WINDOW 3 32 56 VTop 2
SYMATTR InstName R25
SYMATTR Value 400
SYMBOL res -1792 2624 R90
WINDOW 0 0 56 VBottom 2
WINDOW 3 32 56 VTop 2
SYMATTR InstName R26
SYMATTR Value 400
SYMBOL res -1264 2832 R90
WINDOW 0 0 56 VBottom 2
WINDOW 3 32 56 VTop 2
SYMATTR InstName R27
SYMATTR Value 1449
SYMBOL res -1504 2832 R90
WINDOW 0 0 56 VBottom 2
WINDOW 3 32 56 VTop 2
SYMATTR InstName R28
SYMATTR Value 105
SYMBOL voltage -2000 2368 R0
WINDOW 123 0 0 Left 2
WINDOW 39 0 0 Left 2
SYMATTR InstName V7
SYMATTR Value AC 0.5
SYMBOL voltage -2000 2496 R0
WINDOW 123 0 0 Left 2
WINDOW 39 0 0 Left 2
SYMATTR InstName V8
SYMATTR Value AC 0.5
SYMBOL res -1552 2560 R90
WINDOW 0 0 56 VBottom 2
WINDOW 3 32 56 VTop 2
SYMATTR InstName R29
SYMATTR Value 50
SYMBOL res -1552 2448 R90
WINDOW 0 0 56 VBottom 2
WINDOW 3 32 56 VTop 2
SYMATTR InstName R30
SYMATTR Value 50
SYMBOL cap -1552 2496 R0
SYMATTR InstName C15
SYMATTR Value 10p
SYMBOL res -1504 2688 R90
WINDOW 0 0 56 VBottom 2
WINDOW 3 32 56 VTop 2
SYMATTR InstName R31
SYMATTR Value 105
SYMBOL cap -1488 2880 R0
SYMATTR InstName C16
SYMATTR Value 0.5p
SYMBOL cap -1296 2928 R90
WINDOW 0 0 32 VBottom 2
WINDOW 3 32 32 VTop 2
SYMATTR InstName C17
SYMATTR Value 0.1p
SYMBOL AD8129 -1344 2608 R0
WINDOW 0 12 -108 Bottom 2
SYMATTR InstName U5
SYMBOL res -1088 2624 R270
WINDOW 0 32 56 VTop 2
WINDOW 3 0 56 VBottom 2
SYMATTR InstName R32
SYMATTR Value 220
SYMBOL cap -960 2672 R0
SYMATTR InstName C18
SYMATTR Value 750p
SYMBOL res -288 2608 R90
WINDOW 0 0 56 VBottom 2
WINDOW 3 32 56 VTop 2
SYMATTR InstName R33
SYMATTR Value 43
SYMBOL cap -80 2704 R0
SYMATTR InstName C26
SYMATTR Value 120p
SYMBOL res 32 2688 R0
SYMATTR InstName R46
SYMATTR Value 1Meg
SYMBOL opamp2 -624 2560 R0
SYMATTR InstName U6
SYMATTR Value TLV354
SYMBOL res -560 2416 R90
WINDOW 0 0 56 VBottom 2
WINDOW 3 32 56 VTop 2
SYMATTR InstName R47
SYMATTR Value 1.43k
SYMBOL cap -480 2672 R0
SYMATTR InstName C27
SYMATTR Value 5p
SYMBOL res -736 2416 R90
WINDOW 0 0 56 VBottom 2
WINDOW 3 32 56 VTop 2
SYMATTR InstName R48
SYMATTR Value 470
SYMBOL res 1472 -976 R90
WINDOW 0 0 56 VBottom 2
WINDOW 3 32 56 VTop 2
SYMATTR InstName R49
SYMATTR Value 400
SYMBOL res 1456 -688 R90
WINDOW 0 0 56 VBottom 2
WINDOW 3 32 56 VTop 2
SYMATTR InstName R50
SYMATTR Value 400
SYMBOL res 1984 -480 R90
WINDOW 0 0 56 VBottom 2
WINDOW 3 32 56 VTop 2
SYMATTR InstName R51
SYMATTR Value 3297
SYMBOL res 1744 -480 R90
WINDOW 0 0 56 VBottom 2
WINDOW 3 32 56 VTop 2
SYMATTR InstName R52
SYMATTR Value 105
SYMBOL voltage 1248 -944 R0
WINDOW 123 0 0 Left 2
WINDOW 39 0 0 Left 2
SYMATTR InstName V9
SYMATTR Value AC 0.5
SYMBOL voltage 1248 -816 R0
WINDOW 123 0 0 Left 2
WINDOW 39 0 0 Left 2
SYMATTR InstName V12
SYMATTR Value AC 0.5
SYMBOL res 1696 -752 R90
WINDOW 0 0 56 VBottom 2
WINDOW 3 32 56 VTop 2
SYMATTR InstName R53
SYMATTR Value 50
SYMBOL res 1696 -864 R90
WINDOW 0 0 56 VBottom 2
WINDOW 3 32 56 VTop 2
SYMATTR InstName R54
SYMATTR Value 50
SYMBOL cap 1696 -816 R0
SYMATTR InstName C29
SYMATTR Value 10p
SYMBOL res 1744 -624 R90
WINDOW 0 0 56 VBottom 2
WINDOW 3 32 56 VTop 2
SYMATTR InstName R55
SYMATTR Value 105
SYMBOL cap 1760 -432 R0
SYMATTR InstName C30
SYMATTR Value 0.5p
SYMBOL cap 1952 -384 R90
WINDOW 0 0 32 VBottom 2
WINDOW 3 32 32 VTop 2
SYMATTR InstName C31
SYMATTR Value 0.1p
SYMBOL AD8129 1904 -704 R0
WINDOW 0 12 -108 Bottom 2
SYMATTR InstName U9
SYMBOL res 2160 -688 R270
WINDOW 0 32 56 VTop 2
WINDOW 3 0 56 VBottom 2
SYMATTR InstName R56
SYMATTR Value 220
SYMBOL cap 2288 -640 R0
SYMATTR InstName C32
SYMATTR Value 22p
SYMBOL res 2960 -704 R90
WINDOW 0 0 56 VBottom 2
WINDOW 3 32 56 VTop 2
SYMATTR InstName R57
SYMATTR Value 43
SYMBOL cap 3168 -608 R0
SYMATTR InstName C33
SYMATTR Value 120p
SYMBOL res 3280 -624 R0
SYMATTR InstName R58
SYMATTR Value 1Meg
SYMBOL opamp2 2624 -752 R0
SYMATTR InstName U10
SYMATTR Value TLV354
SYMBOL res 2688 -896 R90
WINDOW 0 0 56 VBottom 2
WINDOW 3 32 56 VTop 2
SYMATTR InstName R59
SYMATTR Value 3
SYMBOL cap 2768 -640 R0
SYMATTR InstName C34
SYMATTR Value 5p
SYMBOL res 2512 -896 R90
WINDOW 0 0 56 VBottom 2
WINDOW 3 32 56 VTop 2
SYMATTR InstName R60
SYMATTR Value 470
SYMBOL res 1472 112 R90
WINDOW 0 0 56 VBottom 2
WINDOW 3 32 56 VTop 2
SYMATTR InstName R61
SYMATTR Value 400
SYMBOL res 1456 400 R90
WINDOW 0 0 56 VBottom 2
WINDOW 3 32 56 VTop 2
SYMATTR InstName R62
SYMATTR Value 400
SYMBOL res 1984 608 R90
WINDOW 0 0 56 VBottom 2
WINDOW 3 32 56 VTop 2
SYMATTR InstName R63
SYMATTR Value 3297
SYMBOL res 1744 608 R90
WINDOW 0 0 56 VBottom 2
WINDOW 3 32 56 VTop 2
SYMATTR InstName R64
SYMATTR Value 105
SYMBOL voltage 1248 144 R0
WINDOW 123 0 0 Left 2
WINDOW 39 0 0 Left 2
SYMATTR InstName V13
SYMATTR Value AC 0.5
SYMBOL voltage 1248 272 R0
WINDOW 123 0 0 Left 2
WINDOW 39 0 0 Left 2
SYMATTR InstName V14
SYMATTR Value AC 0.5
SYMBOL res 1696 336 R90
WINDOW 0 0 56 VBottom 2
WINDOW 3 32 56 VTop 2
SYMATTR InstName R65
SYMATTR Value 50
SYMBOL res 1696 224 R90
WINDOW 0 0 56 VBottom 2
WINDOW 3 32 56 VTop 2
SYMATTR InstName R66
SYMATTR Value 50
SYMBOL cap 1696 272 R0
SYMATTR InstName C36
SYMATTR Value 10p
SYMBOL res 1744 464 R90
WINDOW 0 0 56 VBottom 2
WINDOW 3 32 56 VTop 2
SYMATTR InstName R67
SYMATTR Value 105
SYMBOL cap 1760 656 R0
SYMATTR InstName C37
SYMATTR Value 0.5p
SYMBOL cap 1952 704 R90
WINDOW 0 0 32 VBottom 2
WINDOW 3 32 32 VTop 2
SYMATTR InstName C38
SYMATTR Value 0.1p
SYMBOL AD8129 1904 384 R0
WINDOW 0 12 -108 Bottom 2
SYMATTR InstName U11
SYMBOL res 2160 400 R270
WINDOW 0 32 56 VTop 2
WINDOW 3 0 56 VBottom 2
SYMATTR InstName R68
SYMATTR Value 220
SYMBOL cap 2288 448 R0
SYMATTR InstName C39
SYMATTR Value 22p
SYMBOL res 2960 384 R90
WINDOW 0 0 56 VBottom 2
WINDOW 3 32 56 VTop 2
SYMATTR InstName R69
SYMATTR Value 43
SYMBOL cap 3168 480 R0
SYMATTR InstName C40
SYMATTR Value 120p
SYMBOL res 3280 464 R0
SYMATTR InstName R70
SYMATTR Value 1Meg
SYMBOL opamp2 2624 336 R0
SYMATTR InstName U12
SYMATTR Value TLV354
SYMBOL res 2688 192 R90
WINDOW 0 0 56 VBottom 2
WINDOW 3 32 56 VTop 2
SYMATTR InstName R71
SYMATTR Value 1.43k
SYMBOL cap 2768 448 R0
SYMATTR InstName C41
SYMATTR Value 5p
SYMBOL res 2512 192 R90
WINDOW 0 0 56 VBottom 2
WINDOW 3 32 56 VTop 2
SYMATTR InstName R72
SYMATTR Value 470
SYMBOL res 1488 1376 R90
WINDOW 0 0 56 VBottom 2
WINDOW 3 32 56 VTop 2
SYMATTR InstName R73
SYMATTR Value 400
SYMBOL res 1472 1664 R90
WINDOW 0 0 56 VBottom 2
WINDOW 3 32 56 VTop 2
SYMATTR InstName R74
SYMATTR Value 400
SYMBOL res 2000 1872 R90
WINDOW 0 0 56 VBottom 2
WINDOW 3 32 56 VTop 2
SYMATTR InstName R75
SYMATTR Value 3297
SYMBOL res 1760 1872 R90
WINDOW 0 0 56 VBottom 2
WINDOW 3 32 56 VTop 2
SYMATTR InstName R76
SYMATTR Value 105
SYMBOL voltage 1264 1408 R0
WINDOW 123 0 0 Left 2
WINDOW 39 0 0 Left 2
SYMATTR InstName V15
SYMATTR Value AC 0.5
SYMBOL voltage 1264 1536 R0
WINDOW 123 0 0 Left 2
WINDOW 39 0 0 Left 2
SYMATTR InstName V16
SYMATTR Value AC 0.5
SYMBOL res 1712 1600 R90
WINDOW 0 0 56 VBottom 2
WINDOW 3 32 56 VTop 2
SYMATTR InstName R77
SYMATTR Value 50
SYMBOL res 1712 1488 R90
WINDOW 0 0 56 VBottom 2
WINDOW 3 32 56 VTop 2
SYMATTR InstName R78
SYMATTR Value 50
SYMBOL cap 1712 1536 R0
SYMATTR InstName C43
SYMATTR Value 10p
SYMBOL res 1760 1728 R90
WINDOW 0 0 56 VBottom 2
WINDOW 3 32 56 VTop 2
SYMATTR InstName R79
SYMATTR Value 105
SYMBOL cap 1776 1920 R0
SYMATTR InstName C44
SYMATTR Value 0.5p
SYMBOL cap 1968 1968 R90
WINDOW 0 0 32 VBottom 2
WINDOW 3 32 32 VTop 2
SYMATTR InstName C45
SYMATTR Value 0.1p
SYMBOL AD8129 1920 1648 R0
WINDOW 0 12 -108 Bottom 2
SYMATTR InstName U13
SYMBOL res 2176 1664 R270
WINDOW 0 32 56 VTop 2
WINDOW 3 0 56 VBottom 2
SYMATTR InstName R80
SYMATTR Value 220
SYMBOL cap 2304 1712 R0
SYMATTR InstName C46
SYMATTR Value 750p
SYMBOL res 2976 1648 R90
WINDOW 0 0 56 VBottom 2
WINDOW 3 32 56 VTop 2
SYMATTR InstName R81
SYMATTR Value 43
SYMBOL cap 3184 1744 R0
SYMATTR InstName C47
SYMATTR Value 120p
SYMBOL res 3296 1728 R0
SYMATTR InstName R82
SYMATTR Value 1Meg
SYMBOL opamp2 2640 1600 R0
SYMATTR InstName U14
SYMATTR Value TLV354
SYMBOL res 2704 1456 R90
WINDOW 0 0 56 VBottom 2
WINDOW 3 32 56 VTop 2
SYMATTR InstName R83
SYMATTR Value 3
SYMBOL cap 2784 1712 R0
SYMATTR InstName C48
SYMATTR Value 5p
SYMBOL res 2528 1456 R90
WINDOW 0 0 56 VBottom 2
WINDOW 3 32 56 VTop 2
SYMATTR InstName R84
SYMATTR Value 470
SYMBOL res 1488 2464 R90
WINDOW 0 0 56 VBottom 2
WINDOW 3 32 56 VTop 2
SYMATTR InstName R85
SYMATTR Value 400
SYMBOL res 1472 2752 R90
WINDOW 0 0 56 VBottom 2
WINDOW 3 32 56 VTop 2
SYMATTR InstName R86
SYMATTR Value 400
SYMBOL res 2000 2960 R90
WINDOW 0 0 56 VBottom 2
WINDOW 3 32 56 VTop 2
SYMATTR InstName R87
SYMATTR Value 3297
SYMBOL res 1760 2960 R90
WINDOW 0 0 56 VBottom 2
WINDOW 3 32 56 VTop 2
SYMATTR InstName R88
SYMATTR Value 105
SYMBOL voltage 1264 2496 R0
WINDOW 123 0 0 Left 2
WINDOW 39 0 0 Left 2
SYMATTR InstName V17
SYMATTR Value AC 0.5
SYMBOL voltage 1264 2624 R0
WINDOW 123 0 0 Left 2
WINDOW 39 0 0 Left 2
SYMATTR InstName V18
SYMATTR Value AC 0.5
SYMBOL res 1712 2688 R90
WINDOW 0 0 56 VBottom 2
WINDOW 3 32 56 VTop 2
SYMATTR InstName R89
SYMATTR Value 50
SYMBOL res 1712 2576 R90
WINDOW 0 0 56 VBottom 2
WINDOW 3 32 56 VTop 2
SYMATTR InstName R90
SYMATTR Value 50
SYMBOL cap 1712 2624 R0
SYMATTR InstName C50
SYMATTR Value 10p
SYMBOL res 1760 2816 R90
WINDOW 0 0 56 VBottom 2
WINDOW 3 32 56 VTop 2
SYMATTR InstName R91
SYMATTR Value 105
SYMBOL cap 1776 3008 R0
SYMATTR InstName C51
SYMATTR Value 0.5p
SYMBOL cap 1968 3056 R90
WINDOW 0 0 32 VBottom 2
WINDOW 3 32 32 VTop 2
SYMATTR InstName C52
SYMATTR Value 0.1p
SYMBOL AD8129 1920 2736 R0
WINDOW 0 12 -108 Bottom 2
SYMATTR InstName U15
SYMBOL res 2176 2752 R270
WINDOW 0 32 56 VTop 2
WINDOW 3 0 56 VBottom 2
SYMATTR InstName R92
SYMATTR Value 220
SYMBOL cap 2304 2800 R0
SYMATTR InstName C53
SYMATTR Value 750p
SYMBOL res 2976 2736 R90
WINDOW 0 0 56 VBottom 2
WINDOW 3 32 56 VTop 2
SYMATTR InstName R93
SYMATTR Value 43
SYMBOL cap 3184 2832 R0
SYMATTR InstName C54
SYMATTR Value 120p
SYMBOL res 3296 2816 R0
SYMATTR InstName R94
SYMATTR Value 1Meg
SYMBOL opamp2 2640 2688 R0
SYMATTR InstName U16
SYMATTR Value TLV354
SYMBOL res 2704 2544 R90
WINDOW 0 0 56 VBottom 2
WINDOW 3 32 56 VTop 2
SYMATTR InstName R95
SYMATTR Value 1.43k
SYMBOL cap 2784 2800 R0
SYMATTR InstName C55
SYMATTR Value 5p
SYMBOL res 2528 2544 R90
WINDOW 0 0 56 VBottom 2
WINDOW 3 32 56 VTop 2
SYMATTR InstName R96
SYMATTR Value 470
TEXT -2280 -744 Left 2 ;Poor Model of HMC1041Z Sensor\nThere is inductive pickup which extends HF range
TEXT -1576 -416 Left 2 ;parasitic PCB capacitances
TEXT -592 -600 Left 2 ;Analog Switch Capacitance
TEXT -304 -888 Left 2 ;1M of RG174 coax + scope input impedance
TEXT -2280 344 Left 2 ;Poor Model of HMC1041Z Sensor\nThere is inductive pickup which extends HF range
TEXT -1576 672 Left 2 ;parasitic PCB capacitances
TEXT -592 488 Left 2 ;Analog Switch Capacitance
TEXT -304 200 Left 2 ;1M of RG174 coax + scope input impedance
TEXT -2264 1608 Left 2 ;Poor Model of HMC1041Z Sensor\nThere is inductive pickup which extends HF range
TEXT -1560 1936 Left 2 ;parasitic PCB capacitances
TEXT -576 1752 Left 2 ;Analog Switch Capacitance
TEXT -288 1464 Left 2 ;1M of RG174 coax + scope input impedance
TEXT -2264 2696 Left 2 ;Poor Model of HMC1041Z Sensor\nThere is inductive pickup which extends HF range
TEXT -1560 3024 Left 2 ;parasitic PCB capacitances
TEXT -576 2840 Left 2 ;Analog Switch Capacitance
TEXT -288 2552 Left 2 ;1M of RG174 coax + scope input impedance
TEXT 984 -616 Left 2 ;Poor Model of HMC1041Z Sensor\nThere is inductive pickup which extends HF range
TEXT 1688 -288 Left 2 ;parasitic PCB capacitances
TEXT 2672 -472 Left 2 ;Analog Switch Capacitance
TEXT 2960 -760 Left 2 ;1M of RG174 coax + scope input impedance
TEXT 984 472 Left 2 ;Poor Model of HMC1041Z Sensor\nThere is inductive pickup which extends HF range
TEXT 1688 800 Left 2 ;parasitic PCB capacitances
TEXT 2672 616 Left 2 ;Analog Switch Capacitance
TEXT 2960 328 Left 2 ;1M of RG174 coax + scope input impedance
TEXT 1000 1736 Left 2 ;Poor Model of HMC1041Z Sensor\nThere is inductive pickup which extends HF range
TEXT 1704 2064 Left 2 ;parasitic PCB capacitances
TEXT 2688 1880 Left 2 ;Analog Switch Capacitance
TEXT 2976 1592 Left 2 ;1M of RG174 coax + scope input impedance
TEXT 1000 2824 Left 2 ;Poor Model of HMC1041Z Sensor\nThere is inductive pickup which extends HF range
TEXT 1704 3152 Left 2 ;parasitic PCB capacitances
TEXT 2688 2968 Left 2 ;Analog Switch Capacitance
TEXT 2976 2680 Left 2 ;1M of RG174 coax + scope input impedance
TEXT -1160 -1248 Left 2 ;Min Sensor Gain, high bandwidth, low output gain
TEXT -1024 -48 Left 2 ;Min Sensor Gain, high bandwidth, high output gain
TEXT -952 1208 Left 2 ;Min Sensor Gain, low bandwidth, low output gain
TEXT -920 2304 Left 2 ;Min Sensor Gain, low bandwidth, high output gain
TEXT 1840 -1096 Left 2 ;Max Sensor Gain, high bandwidth, low output gain
TEXT 2096 -8 Left 2 ;Max Sensor Gain, high bandwidth, high output gain
TEXT 2280 1264 Left 2 ;Max Sensor Gain, low bandwidth, low output gain
TEXT 2352 2408 Left 2 ;Max Sensor Gain, low bandwidth, high output gain
TEXT -2272 3248 Left 2 !.INC TLV354.LIB\n.INC ad8129.CIR
TEXT -2280 3352 Left 2 !.ac dec 100 1k 100E6

The netlist it stands for:
* amplifier.asc
V1 +2.5V 0 2.5
V2 0 -2.5V 2.5
R34 N002 N001 400
R35 N010 N016 400
R36 N013 N018 1449
R37 N018 0 105
V10 N001 0 AC 0.5
V11 0 N016 AC 0.5
R38 N011 N010 50
R39 N005 N002 50
C19 N005 N011 10p
R40 N017 0 105
C20 N018 0 0.5p
C21 N013 N018 0.1p
XU7 N005 N011 N017 N018 +2.5V -2.5V N013 AD8129  ; pins IN+ IN- REF FB V+ V- OUT
R41 N013 N014 220
C22 N014 0 22p
R44 N015 N004 43
C23 N015 0 120p
R45 N015 0 1Meg
XU8 N014 N003 +2.5V -2.5V N004 TLV354  ; pins In+ In- V+ V- OUT
R42 N004 N003 3
C24 N004 0 5p
R43 N003 0 470
R1 N028 N027 400
R2 N036 N042 400
R3 N039 N044 1449
R4 N044 0 105
V3 N027 0 AC 0.5
V4 0 N042 AC 0.5
R5 N037 N036 50
R6 N031 N028 50
C1 N031 N037 10p
R7 N043 0 105
C2 N044 0 0.5p
C3 N039 N044 0.1p
XU1 N031 N037 N043 N044 +2.5V -2.5V N039 AD8129  ; pins IN+ IN- REF FB V+ V- OUT
R8 N039 N040 220
C4 N040 0 22p
R9 N041 N030 43
C5 N041 0 120p
R10 N041 0 1Meg
XU2 N040 N029 +2.5V -2.5V N030 TLV354  ; pins In+ In- V+ V- OUT
R11 N030 N029 1.43k
C6 N030 0 5p
R12 N029 0 470
R13 N054 N053 400
R14 N062 N068 400
R15 N065 N070 1449
R16 N070 0 105
V5 N053 0 AC 0.5
V6 0 N068 AC 0.5
R17 N063 N062 50
R18 N057 N054 50
C8 N057 N063 10p
R19 N069 0 105
C9 N070 0 0.5p
C10 N065 N070 0.1p
XU3 N057 N063 N069 N070 +2.5V -2.5V N065 AD8129  ; pins IN+ IN- REF FB V+ V- OUT
R20 N065 N066 220
C11 N066 0 750p
R21 N067 N056 43
C12 N067 0 120p
R22 N067 0 1Meg
XU4 N066 N055 +2.5V -2.5V N056 TLV354  ; pins In+ In- V+ V- OUT
R23 N056 N055 3
C13 N056 0 5p
R24 N055 0 470
R25 N080 N079 400
R26 N088 N094 400
R27 N091 N096 1449
R28 N096 0 105
V7 N079 0 AC 0.5
V8 0 N094 AC 0.5
R29 N089 N088 50
R30 N083 N080 50
C15 N083 N089 10p
R31 N095 0 105
C16 N096 0 0.5p
C17 N091 N096 0.1p
XU5 N083 N089 N095 N096 +2.5V -2.5V N091 AD8129  ; pins IN+ IN- REF FB V+ V- OUT
R32 N091 N092 220
C18 N092 0 750p
R33 N093 N082 43
C26 N093 0 120p
R46 N093 0 1Meg
XU6 N092 N081 +2.5V -2.5V N082 TLV354  ; pins In+ In- V+ V- OUT
R47 N082 N081 1.43k
C27 N082 0 5p
R48 N081 0 470
R49 N007 N006 400
R50 N019 N024 400
R51 N021 N026 3297
R52 N026 0 105
V9 N006 0 AC 0.5
V12 0 N024 AC 0.5
R53 N020 N019 50
R54 N012 N007 50
C29 N012 N020 10p
R55 N025 0 105
C30 N026 0 0.5p
C31 N021 N026 0.1p
XU9 N012 N020 N025 N026 +2.5V -2.5V N021 AD8129  ; pins IN+ IN- REF FB V+ V- OUT
R56 N021 N022 220
C32 N022 0 22p
R57 N023 N009 43
C33 N023 0 120p
R58 N023 0 1Meg
XU10 N022 N008 +2.5V -2.5V N009 TLV354  ; pins In+ In- V+ V- OUT
R59 N009 N008 3
C34 N009 0 5p
R60 N008 0 470
R61 N033 N032 400
R62 N045 N050 400
R63 N047 N052 3297
R64 N052 0 105
V13 N032 0 AC 0.5
V14 0 N050 AC 0.5
R65 N046 N045 50
R66 N038 N033 50
C36 N038 N046 10p
R67 N051 0 105
C37 N052 0 0.5p
C38 N047 N052 0.1p
XU11 N038 N046 N051 N052 +2.5V -2.5V N047 AD8129  ; pins IN+ IN- REF FB V+ V- OUT
R68 N047 N048 220
C39 N048 0 22p
R69 N049 N035 43
C40 N049 0 120p
R70 N049 0 1Meg
XU12 N048 N034 +2.5V -2.5V N035 TLV354  ; pins In+ In- V+ V- OUT
R71 N035 N034 1.43k
C41 N035 0 5p
R72 N034 0 470
R73 N059 N058 400
R74 N071 N076 400
R75 N073 N078 3297
R76 N078 0 105
V15 N058 0 AC 0.5
V16 0 N076 AC 0.5
R77 N072 N071 50
R78 N064 N059 50
C43 N064 N072 10p
R79 N077 0 105
C44 N078 0 0.5p
C45 N073 N078 0.1p
XU13 N064 N072 N077 N078 +2.5V -2.5V N073 AD8129  ; pins IN+ IN- REF FB V+ V- OUT
R80 N073 N074 220
C46 N074 0 750p
R81 N075 N061 43
C47 N075 0 120p
R82 N075 0 1Meg
XU14 N074 N060 +2.5V -2.5V N061 TLV354  ; pins In+ In- V+ V- OUT
R83 N061 N060 3
C48 N061 0 5p
R84 N060 0 470
R85 N085 N084 400
R86 N097 N102 400
R87 N099 N104 3297
R88 N104 0 105
V17 N084 0 AC 0.5
V18 0 N102 AC 0.5
R89 N098 N097 50
R90 N090 N085 50
C50 N090 N098 10p
R91 N103 0 105
C51 N104 0 0.5p
C52 N099 N104 0.1p
XU15 N090 N098 N103 N104 +2.5V -2.5V N099 AD8129  ; pins IN+ IN- REF FB V+ V- OUT
R92 N099 N100 220
C53 N100 0 750p
R93 N101 N087 43
C54 N101 0 120p
R94 N101 0 1Meg
XU16 N100 N086 +2.5V -2.5V N087 TLV354  ; pins In+ In- V+ V- OUT
R95 N087 N086 1.43k
C55 N087 0 5p
R96 N086 0 470
* Poor Model of HMC1041Z Sensor
* There is inductive pickup which extends HF range
* parasitic PCB capacitances
* Analog Switch Capacitance
* 1M of RG174 coax + scope input impedance
* Poor Model of HMC1041Z Sensor
* There is inductive pickup which extends HF range
* parasitic PCB capacitances
* Analog Switch Capacitance
* 1M of RG174 coax + scope input impedance
* Poor Model of HMC1041Z Sensor
* There is inductive pickup which extends HF range
* parasitic PCB capacitances
* Analog Switch Capacitance
* 1M of RG174 coax + scope input impedance
* Poor Model of HMC1041Z Sensor
* There is inductive pickup which extends HF range
* parasitic PCB capacitances
* Analog Switch Capacitance
* 1M of RG174 coax + scope input impedance
* Poor Model of HMC1041Z Sensor
* There is inductive pickup which extends HF range
* parasitic PCB capacitances
* Analog Switch Capacitance
* 1M of RG174 coax + scope input impedance
* Poor Model of HMC1041Z Sensor
* There is inductive pickup which extends HF range
* parasitic PCB capacitances
* Analog Switch Capacitance
* 1M of RG174 coax + scope input impedance
* Poor Model of HMC1041Z Sensor
* There is inductive pickup which extends HF range
* parasitic PCB capacitances
* Analog Switch Capacitance
* 1M of RG174 coax + scope input impedance
* Poor Model of HMC1041Z Sensor
* There is inductive pickup which extends HF range
* parasitic PCB capacitances
* Analog Switch Capacitance
* 1M of RG174 coax + scope input impedance
* Min Sensor Gain, high bandwidth, low output gain
* Min Sensor Gain, high bandwidth, high output gain
* Min Sensor Gain, low bandwidth, low output gain
* Min Sensor Gain, low bandwidth, high output gain
* Max Sensor Gain, high bandwidth, low output gain
* Max Sensor Gain, high bandwidth, high output gain
* Max Sensor Gain, low bandwidth, low output gain
* Max Sensor Gain, low bandwidth, high output gain
.INC TLV354.LIB
.INC ad8129.CIR
.ac dec 100 1k 100E6
.lib Z:\home\wbraun\Projects\little-bee\modeling\ad8129.cir
.backanno
.end